# EAGLE design AnalogIntensityBar (EAGLE 6.4)
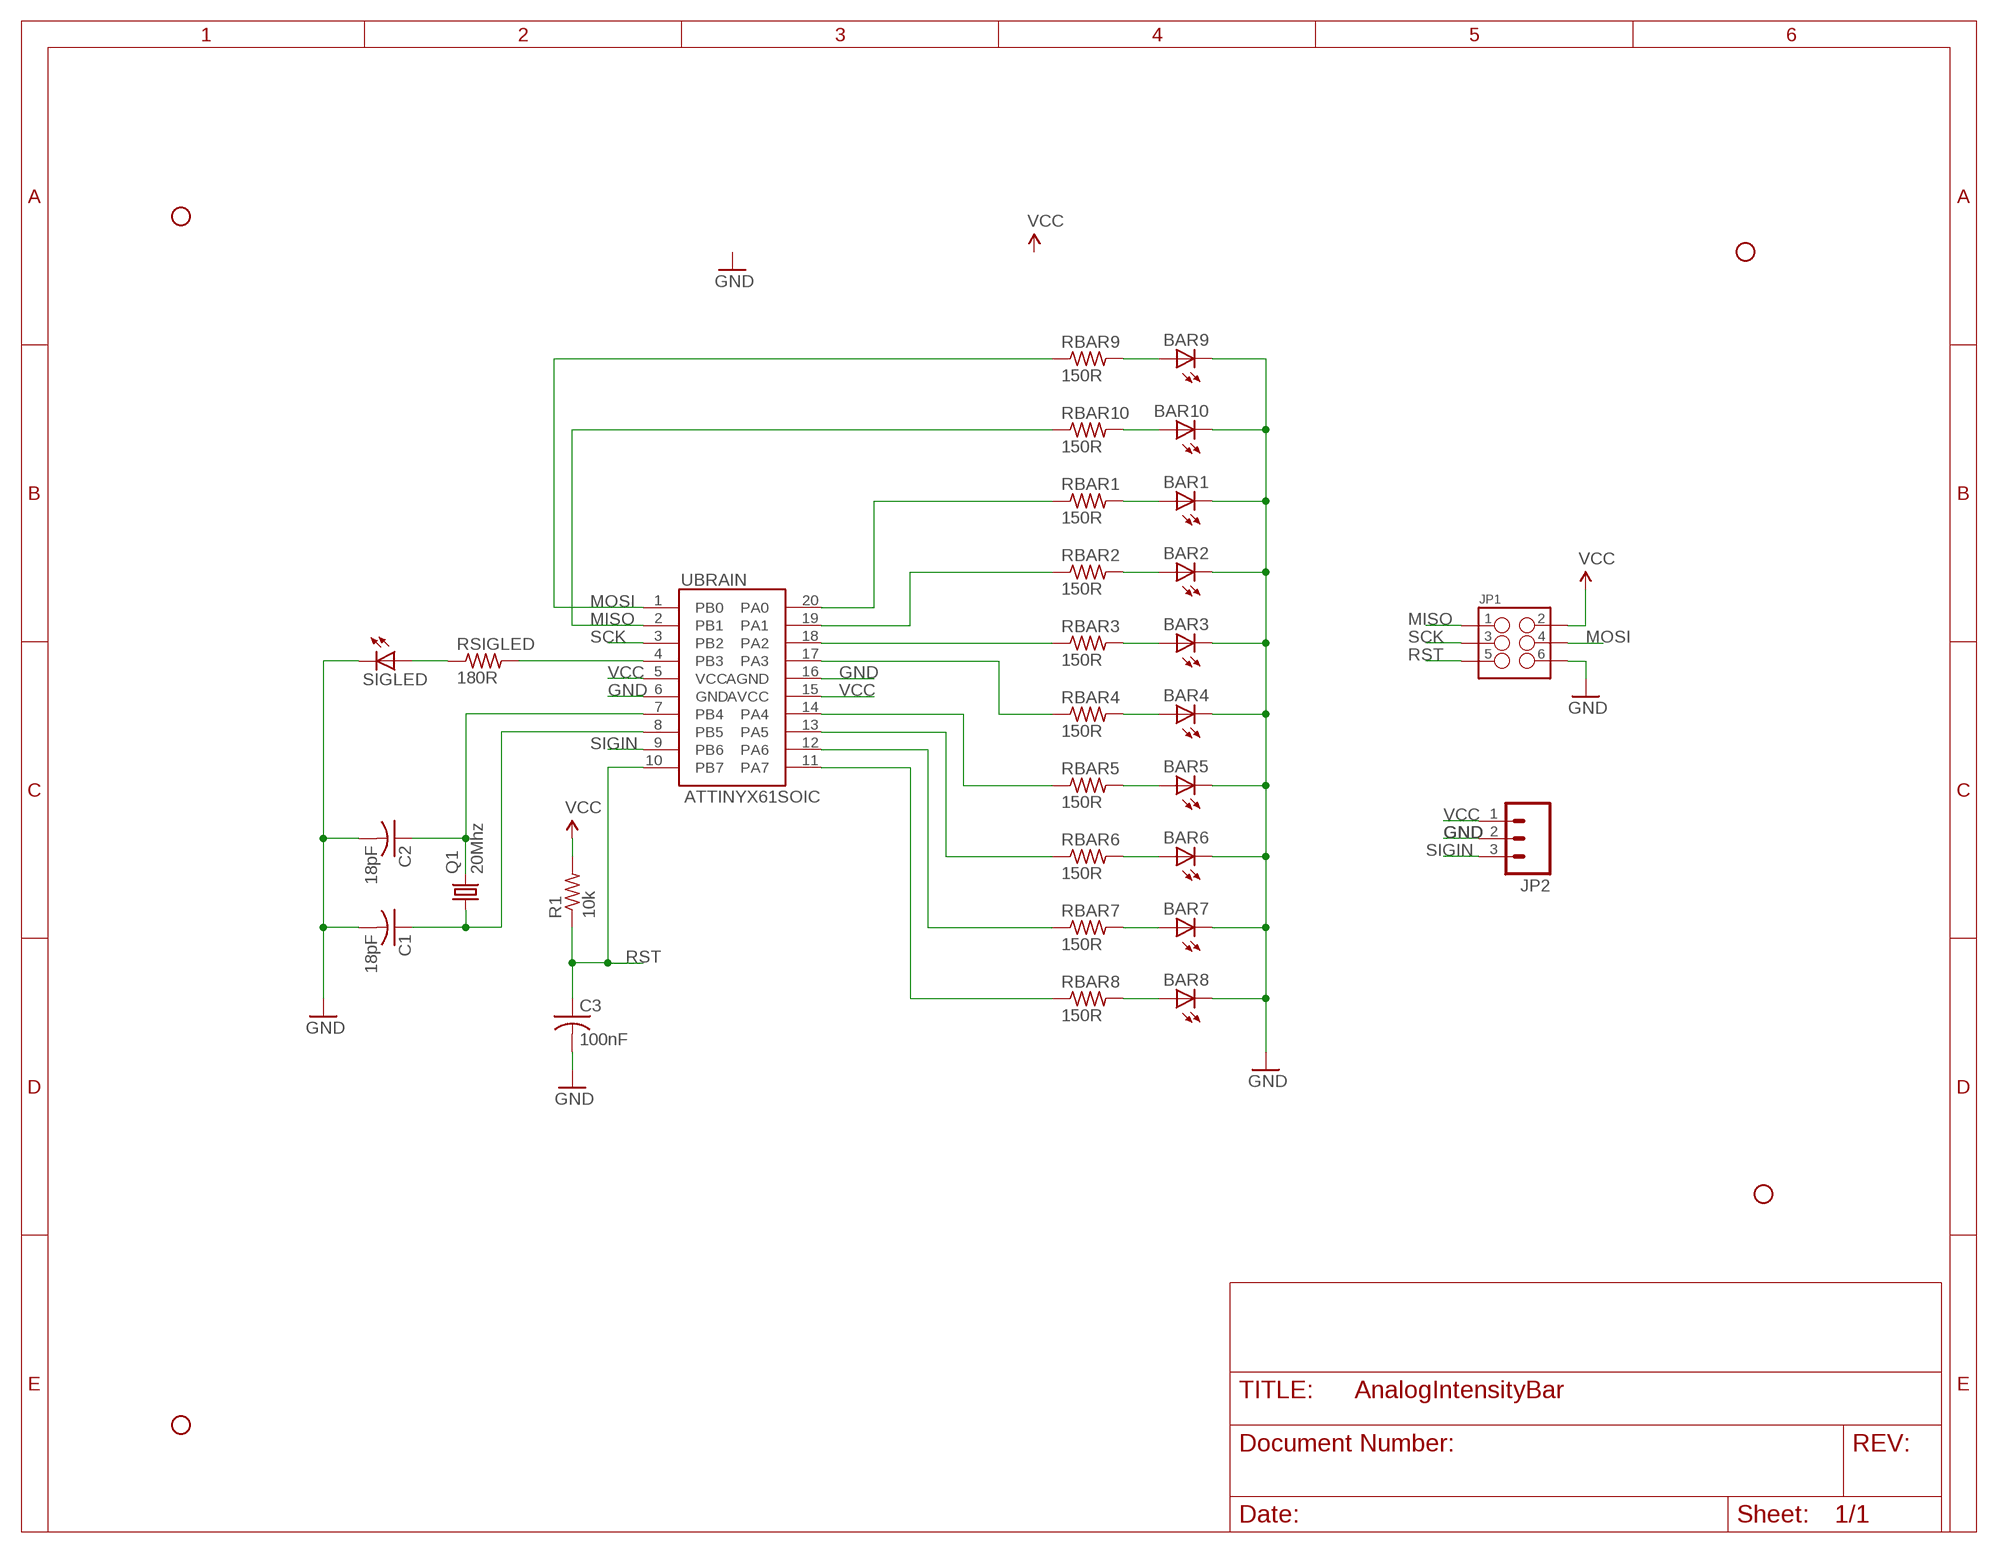
[diagram p0: schematic, sheet 1]

## Parts
BAR1  LEDCHIP-LED0603  [CHIP-LED0603]
BAR2  LEDCHIP-LED0603  [CHIP-LED0603]
BAR3  LEDCHIP-LED0603  [CHIP-LED0603]
BAR4  LEDCHIP-LED0603  [CHIP-LED0603]
BAR5  LEDCHIP-LED0603  [CHIP-LED0603]
BAR6  LEDCHIP-LED0603  [CHIP-LED0603]
BAR7  LEDCHIP-LED0603  [CHIP-LED0603]
BAR8  LEDCHIP-LED0603  [CHIP-LED0603]
BAR9  LEDCHIP-LED0603  [CHIP-LED0603]
BAR10  LEDCHIP-LED0603  [CHIP-LED0603]
C1  18pF  C-USC0402  [C0402]
C2  18pF  C-USC0402  [C0402]
C3  100nF  C-USC0402  [C0402]
JP1  M03X22X3_SILK_SM  [2X3]
JP2  M03PTH  [1X03]
Q1  20Mhz  CRYSTALHC49UP  [HC49UP]
R1  10k  R-US_R0402  [R0402]
RBAR1  150R  R-US_R0603  [R0603]
RBAR2  150R  R-US_R0603  [R0603]
RBAR3  150R  R-US_R0603  [R0603]
RBAR4  150R  R-US_R0603  [R0603]
RBAR5  150R  R-US_R0603  [R0603]
RBAR6  150R  R-US_R0603  [R0603]
RBAR7  150R  R-US_R0603  [R0603]
RBAR8  150R  R-US_R0603  [R0603]
RBAR9  150R  R-US_R0603  [R0603]
RBAR10  150R  R-US_R0603  [R0603]
RSIGLED  180R  R-US_R0603  [R0603]
SIGLED  LEDCHIP-LED0805  [CHIP-LED0805]
STANDOFF1  STAND-OFF  [STAND-OFF]
STANDOFF2  STAND-OFF  [STAND-OFF]
STANDOFF3  STAND-OFF  [STAND-OFF]
STANDOFF4  STAND-OFF  [STAND-OFF]
UBRAIN  ATTINYX61SOIC  [20S2]

## Nets
GND [ground]: BAR1.C BAR2.C BAR3.C BAR4.C BAR5.C BAR6.C BAR7.C BAR8.C BAR9.C BAR10.C C1.2 C2.2 C3.2 JP1.6 JP2.2 SIGLED.C UBRAIN.6(GND) UBRAIN.16(AGND)
MISO: JP1.1 RBAR10.1 UBRAIN.2(PB1)
MOSI: JP1.4 RBAR9.1 UBRAIN.1(PB0)
N$1: RBAR1.1 UBRAIN.20(PA0)
N$2: RBAR2.1 UBRAIN.19(PA1)
N$3: C1.1 Q1.1 UBRAIN.8(PB5)
N$4: C2.1 Q1.2 UBRAIN.7(PB4)
N$5: RBAR3.1 UBRAIN.18(PA2)
N$6: RBAR4.1 UBRAIN.17(PA3)
N$7: RBAR5.1 UBRAIN.14(PA4)
N$8: RBAR6.1 UBRAIN.13(PA5)
N$9: RBAR7.1 UBRAIN.12(PA6)
N$10: RBAR8.1 UBRAIN.11(PA7)
N$11: BAR1.A RBAR1.2
N$12: BAR2.A RBAR2.2
N$13: BAR3.A RBAR3.2
N$14: BAR4.A RBAR4.2
N$15: BAR5.A RBAR5.2
N$16: BAR6.A RBAR6.2
N$17: BAR7.A RBAR7.2
N$18: BAR8.A RBAR8.2
N$19: RSIGLED.2 UBRAIN.4(PB3)
N$20: RSIGLED.1 SIGLED.A
N$23: BAR9.A RBAR9.2
N$24: BAR10.A RBAR10.2
RST: C3.1 JP1.5 R1.1 UBRAIN.10(PB7)
SCK: JP1.3 UBRAIN.3(PB2)
SIGIN: JP2.3 UBRAIN.9(PB6)
VCC [vcc]: JP1.2 JP2.1 R1.2 UBRAIN.5(VCC) UBRAIN.15(AVCC)

## Library data of the parts
BAR1-BAR10 SIGLED = led:LED: LED OSRAM: - CHIPLED LG R971, LG N971, LY N971, LG Q971, LY Q971, LO R971, LY R971 LH N974, LH R974 LS Q976, LO Q976, LY Q976 LO Q996 - Hyper CHIPLED LW Q18S LB Q993, LB Q99A, LB R99A - SideLED LS A670, LO A670, LY A670, LG A670, LP A670 LB A673, LV A673, LT A673, LW A673 LH A674 LY A675 LS A676, LA A676, LO A676, LY A676, LW A676 LS A679, LY A679, LG A679 - Hyper Micro SIDELED® LS Y876, LA Y876, LO Y876, LY Y876 LT Y87S - SmartLED LW L88C, LW L88S LB L89C, LB L89S, LG L890 LS L89K, LO L89K, LY L89K LS L896, LA L896, LO L896, LY L896 - TOPLED LS T670, LO T670, LY T670, LG T670, LP T670 LSG T670, LSP T670, LSY T670, LOP T670, LYG T670 LG T671, LOG T671, LSG T671 LB T673, LV T673, LT T673, LW T673 LH T674 LS T676, LA T676, LO T676, LY T676, LB T676, LH T676, LSB T676, LW T676 LB T67C, LV T67C, LT T67C, LS T67K, LO T67K, LY T67K, LW E67C LS E67B, LA E67B, LO E67B, LY E67B, LB E67C, LV E67C, LT E67C LW T67C LS T679, LY T679, LG T679 LS T770, LO T770, LY T770, LG T770, LP T770 LB T773, LV T773, LT T773, LW T773 LH T774 LS E675, LA E675, LY E675, LS T675 LS T776, LA T776, LO T776, LY T776, LB T776 LHGB T686 LT T68C, LB T68C - Hyper Mini TOPLED® LB M676 - Mini TOPLED Santana® LG M470 LS M47K, LO M47K, LY M47K Source: http://www.osram.convergy.de LUXEON: - LUMILED® LXK2-PW12-R00, LXK2-PW12-S00, LXK2-PW14-U00, LXK2-PW14-V00 LXK2-PM12-R00, LXK2-PM12-S00, LXK2-PM14-U00 LXK2-PE12-Q00, LXK2-PE12-R00, LXK2-PE12-S00, LXK2-PE14-T00, LXK2-PE14-U00 LXK2-PB12-K00, LXK2-PB12-L00, LXK2-PB12-M00, LXK2-PB14-N00, LXK2-PB14-P00, LXK2-PB14-Q00 LXK2-PR12-L00, LXK2-PR12-M00, LXK2-PR14-Q00, LXK2-PR14-R00 LXK2-PD12-Q00, LXK2-PD12-R00, LXK2-PD12-S00 LXK2-PH12-R00, LXK2-PH12-S00 LXK2-PL12-P00, LXK2-PL12-Q00, LXK2-PL12-R00 Source: www.luxeon.com KINGBRIGHT: KA-3528ASYC Source: www.kingbright.com
C1-C3 = resistor:C-US: CAPACITOR, American symbol
JP1 = SparkFun-Connectors:M03X2: 2x3 .1" header. Shrouded, with keying- CONN-10681 SMT- CONN-11415 Pogo pins- HW-11044
JP2 = SparkFun-Connectors:M03: Header 3 Standard 3-pin 0.1" header. Use with straight break away headers (SKU : PRT-00116), right angle break away headers (PRT-00553), swiss pins (PRT-00743), machine pins (PRT-00117), and female headers (PRT-00115). Molex polarized connector foot print use with SKU : PRT-08232 with associated crimp pins and housings.
Q1 = crystal:CRYSTAL: CRYSTAL; OC_FARNELL: unknown; OC_NEWARK: unknown
R1 RBAR1-RBAR10 RSIGLED = resistor:R-US_: RESISTOR, American symbol
STANDOFF1-STANDOFF4 = SparkFun-Electromechanical:STAND-OFF: #4 Stand Off This is the mechanical footprint for a #4 phillips button head screw. Use the keepout ring to avoid running the screw head into surrounding components. SKU : PRT-00447
UBRAIN = ATtinyX61:ATTINYX61

## Net classes
1 ground: width 0.254 mm
2 vcc: width 0.254 mm

## Board
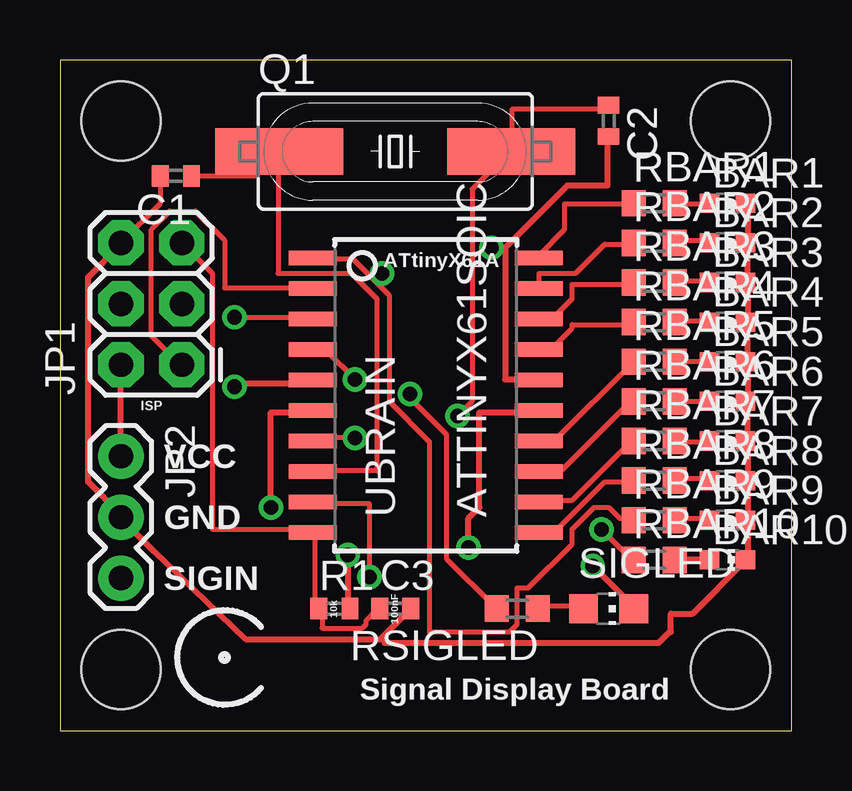
[diagram p1: board, top side]
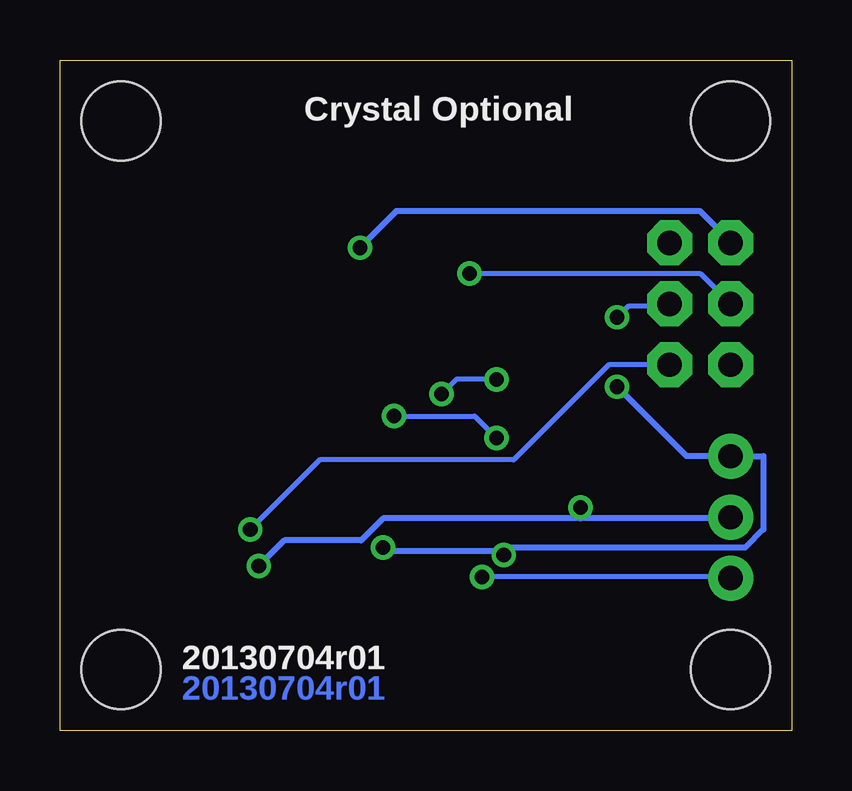
[diagram p2: board, bottom side, seen from below]

Size 30.48 x 27.94 mm. Coordinates in mm from the lower left corner, seen from the top.
Outline: 0,0 30.48,0 30.48,27.94 0,27.94 0,0
Copper layers (1*16): Top 0.035mm / dielectric 1.5mm / Bottom 0.035mm
Design rules "default *": minimum track width 8mil, minimum drill 24mil, track to track 8mil, track to pad 8mil, pad to pad 8mil, via to via 8mil, smd to smd 8mil, copper to edge 40mil, drill to drill 8mil, minimum pad ring 10mil, minimum via ring 8mil, stop-mask expansion 4mil, vias tented up to drill 25mil, thermal gap 10mil

### Footprints (pad centres in the part's own frame; a part is rotated, then mirrored left to right if it is on the bottom)
CHIP-LED0603 = smd 0.8 x 0.8: A 0,-0.75; C 0,0.75
C0402 = smd 0.7 x 0.9: 1 -0.65,0; 2 0.65,0
2X3 = drill 1.016 pad 1.88 octagon: 1 0,0; 2 0,2.54; 3 2.54,0; 4 2.54,2.54; 5 5.08,0; 6 5.08,2.54
1X03 = drill 1.016 pad 1.88: 1 0,0; 2 2.54,0; 3 5.08,0
HC49UP = smd 5.334 x 1.93: 1 -4.826,0; 2 4.826,0
R0402 = smd 0.7 x 0.9: 1 -0.65,0; 2 0.65,0
R0603 = smd 1 x 1.1: 1 -0.85,0; 2 0.85,0
CHIP-LED0805 = smd 1.2 x 1.2: A 0,-1.05; C 0,1.05
STAND-OFF = hole 3.302: 0,0
20S2 = smd 0.6 x 2: 1 5.715,4.7; 2 4.445,4.7; 3 3.175,4.7; 4 1.905,4.7; 5 0.635,4.7; 6 -0.635,4.7; 7 -1.905,4.7; 8 -3.175,4.7; 9 -4.445,4.7; 10 -5.715,4.7; 11 -5.715,-4.7; 12 -4.445,-4.7; 13 -3.175,-4.7; 14 -1.905,-4.7; 15 -0.635,-4.7; 16 0.635,-4.7; 17 1.905,-4.7; 18 3.175,-4.7; 19 4.445,-4.7; 20 5.715,-4.7

### Placement (x,y rotation side)
BAR1  27.81,21.97 270 top
BAR2  27.81,20.32 270 top
BAR3  27.81,18.67 270 top
BAR4  27.81,17.02 270 top
BAR5  27.81,15.37 270 top
BAR6  27.81,13.72 270 top
BAR7  27.81,12.06 270 top
BAR8  27.81,10.41 270 top
BAR9  27.81,8.76 270 top
BAR10  27.81,7.11 270 top
C1  4.83,23.11 180 top
C2  22.86,25.4 270 top
C3  13.97,5.08 0 top
JP1  5.08,15.24 90 top
JP2  2.54,11.43 270 top
Q1  13.97,24.13 0 top
R1  11.43,5.08 0 top
RBAR1  24.77,21.97 0 top
RBAR2  24.77,20.32 0 top
RBAR3  24.77,18.67 0 top
RBAR4  24.77,17.02 0 top
RBAR5  24.77,15.37 0 top
RBAR6  24.77,13.72 0 top
RBAR7  24.77,12.06 0 top
RBAR8  24.77,10.41 0 top
RBAR9  24.77,8.76 0 top
RBAR10  24.77,7.11 0 top
RSIGLED  19.05,5.08 180 top
SIGLED  22.86,5.08 270 top
STANDOFF1  2.54,2.54 0 top
STANDOFF2  27.94,2.54 0 top
STANDOFF3  2.54,25.4 0 top
STANDOFF4  27.94,25.4 0 top
UBRAIN  15.24,13.97 90 top

### Tracks (layer width: path | path; a pad name or v marks a point on that pad's centre or on a via)
GND  (via drill 0.61)
  Top 0.203: C1.2 4.18,21.96 JP1.6
  Top 0.254: 22.96,24.69 C2.2 22.81,24.69 22.81,22.71 21.13,22.71 18.54,20.12 | 18.54,20.12 18.54,14.63 19.91,14.63 UBRAIN.16 | 13.44,3.89 13.36,3.81 7.72,3.81 3.91,7.47 2.54,8.84 JP2.2 2.54,8.99 1.17,10.36 1.17,18.9 2.54,20.27 JP1.6 | 13.44,3.89 14.58,5.03 C3.2 | v22.2,6.86 23.88,5.18 SIGLED.C | v8.79,9.3 8.79,13.26 10.46,13.26 UBRAIN.6 | 13.44,3.89 13.51,3.81 13.51,3.66 24.94,3.66 25.4,4.12 25.45,4.12 25.45,4.88 26.36,4.88 28.5,7.01 BAR10.C 28.65,7.16 28.65,8.69 BAR9.C 28.65,8.84 28.65,10.36 BAR8.C 28.65,10.52 28.65,12.04 BAR7.C 28.65,12.19 28.65,13.72 | BAR1.C 28.65,21.95 28.65,20.42 BAR2.C 28.65,20.27 28.65,18.75 BAR3.C 28.65,18.59 28.65,17.07 BAR4.C 28.65,16.92 28.65,15.39 BAR5.C 28.65,15.24 28.65,13.72 | 28.65,13.72 BAR6.C | v17.98,20.12 18.54,20.12
  Bottom 0.254: v22.2,6.86 21.13,7.92 17.93,7.92 17.02,8.84 8.79,8.84 | 8.79,8.84 2.54,8.84 JP2.2 | 8.79,8.84 v8.79,9.3 | v17.98,20.12 16.46,21.64 3.81,21.64 2.59,20.42 JP1.6
MISO  (via drill 0.61)
  Top 0.203: v22.55,8.38 23.77,7.16 RBAR10.1 | UBRAIN.2 10.52,18.44 6.86,18.44 6.86,20.42 5.64,21.64 4.57,21.64 3.81,20.88 3.81,16.46 5.03,15.24 JP1.1
  Bottom 0.203: v22.55,8.38 19.66,11.28 11.58,11.28 7.62,15.24 JP1.1
MOSI  (via drill 0.61)
  Top 0.203: 13.11,18.75 12.19,19.66 10.67,19.66 UBRAIN.1 | 13.11,18.75 13.72,18.14 13.72,13.72 15.39,12.04 15.39,4.12 18.75,4.12 19.05,4.42 19.05,5.94 19.51,5.94 21.34,7.77 21.34,8.38 22.25,9.3 22.86,9.3 23.32,8.84 23.77,8.84 RBAR9.1 | 13.11,18.75 v13.41,19.05
  Bottom 0.203: JP1.4 3.81,19.05 v13.41,19.05
N$1
  Top 0.203: RBAR1.1 23.77,21.95 21.03,21.95 21.03,20.88 19.96,19.81 UBRAIN.20
N$2
  Top 0.203: RBAR2.1 23.77,20.27 22.71,20.27 21.49,19.05 19.96,19.05 19.96,18.44 UBRAIN.19
N$3
  Top 0.203: 9.09,24.23 Q1.1 | UBRAIN.8 10.62,10.82 13.21,10.82 13.21,17.98 12.14,19.05 9.09,19.05 9.09,24.08 Q1.1 | C1.1 8.13,23.11 Q1.1
N$4  (via drill 0.61)
  Top 0.203: C2.1 22.81,25.91 18.85,25.91 18.85,24.23 Q1.2 18.69,24.08 17.17,22.55 17.17,13.72 v16.56,13.11 | v12.29,12.19 10.62,12.19 UBRAIN.7
  Bottom 0.203: v12.29,12.19 13.21,13.11 v16.56,13.11
N$5
  Top 0.203: RBAR3.1 23.77,18.59 21.34,18.59 21.34,17.98 20.57,17.22 19.96,17.22 UBRAIN.18
N$6
  Top 0.203: RBAR4.1 23.77,16.92 21.34,16.92 21.34,16.76 20.57,16 19.96,16 UBRAIN.17
N$7
  Top 0.203: RBAR5.1 23.77,15.24 20.73,12.19 19.96,12.19 UBRAIN.14
N$8
  Top 0.203: RBAR6.1 23.77,13.72 20.88,10.82 19.96,10.82 UBRAIN.13
N$9
  Top 0.203: RBAR7.1 23.77,12.04 21.34,9.6 19.96,9.6 UBRAIN.12
N$10
  Top 0.203: RBAR8.1 23.77,10.36 22.71,10.36 20.73,8.38 19.96,8.38 UBRAIN.11
N$11
  Top 0.203: BAR1.A 26.98,21.95 25.76,21.95 RBAR1.2
N$12
  Top 0.203: BAR2.A 26.98,20.42 25.76,20.42 RBAR2.2
N$13
  Top 0.203: BAR3.A 26.98,18.75 25.76,18.75 RBAR3.2
N$14
  Top 0.203: BAR4.A 26.98,17.07 25.76,17.07 RBAR4.2
N$15
  Top 0.203: BAR5.A 26.98,15.39 25.76,15.39 RBAR5.2
N$16
  Top 0.203: RBAR6.2 BAR6.A
N$17
  Top 0.203: BAR7.A 26.98,12.04 25.76,12.04 RBAR7.2
N$18
  Top 0.203: BAR8.A 26.98,10.52 25.76,10.52 RBAR8.2
N$19  (via drill 0.61)
  Top 0.203: v14.58,14.02 14.58,13.87 16.1,12.34 16.1,7.16 18.09,5.18 RSIGLED.2 | v12.29,14.63 11.07,15.85 10.62,15.85 UBRAIN.4
  Bottom 0.203: v14.58,14.02 13.97,14.63 v12.29,14.63
N$20
  Top 0.203: RSIGLED.1 19.91,5.18 21.74,5.18 SIGLED.A
N$23
  Top 0.203: BAR9.A 26.98,8.84 25.76,8.84 RBAR9.2
N$24
  Top 0.203: BAR10.A 26.98,7.16 25.76,7.16 RBAR10.2
RST
  Top 0.203: C3.1 13.21,5.03 12.75,4.57 12.75,4.42 12.6,4.27 10.92,4.27 10.92,5.03 R1.1 10.77,5.18 10.62,5.33 10.62,8.23 UBRAIN.10 10.46,8.38 6.35,8.38 6.35,19.05 JP1.5
SCK  (via drill 0.61)
  Top 0.203: v7.26,17.22 10.46,17.22 UBRAIN.3
  Bottom 0.203: v7.26,17.22 6.81,17.68 5.13,17.68 JP1.3
SIGIN  (via drill 0.61)
  Top 0.203: v12.9,6.4 12.9,9.45 10.62,9.45 UBRAIN.9
  Bottom 0.203: v12.9,6.4 2.54,6.4 JP2.3
VCC  (via drill 0.61)
  Top 0.254: v11.99,7.32 11.99,5.18 R1.2 | v7.26,14.33 7.26,14.48 10.46,14.48 UBRAIN.5 | v17.02,7.62 17.02,8.84 17.48,9.3 17.48,13.26 19.91,13.26 UBRAIN.15 | JP2.1 JP1.2
  Bottom 0.254: v7.26,14.33 4.37,11.43 JP2.1 1.17,11.43 1.17,8.38 1.93,7.62 11.68,7.62 v11.99,7.32 11.99,7.47 16.87,7.47 v17.02,7.62

### Text on the board
Bottom: 20130704r01
tPlace: ATtinyX61A | ISP | VCC | GND | SIGIN | 10k | 100nF | Signal Display Board
bPlace: Crystal Optional | 20130704r01